# Altium schematic sheet Power - 5V0_.SchDoc
size A4
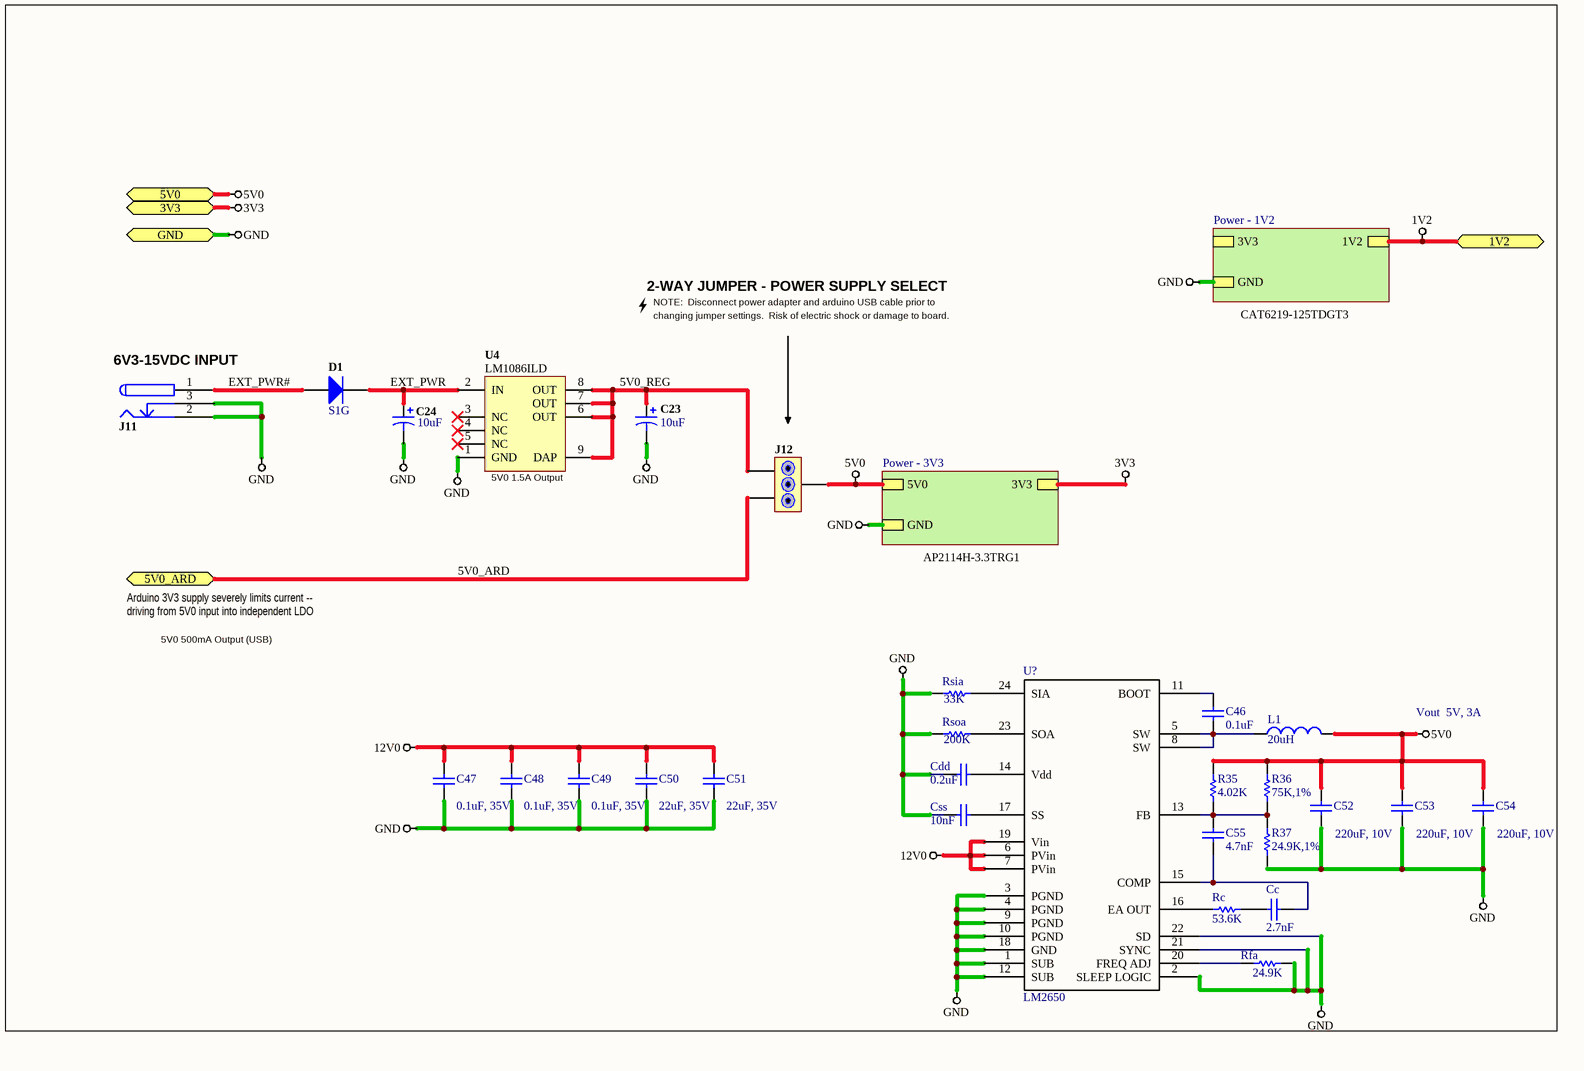
[diagram p0: Power - 5V0_.SchDoc]

## Parts
C23  Capacitance: 10uF  [AVX-CAPC3528_V]  (hidden comment: TAJB106K020R)
C24  Capacitance: 10uF  [AVX-CAPC3528_V]  (hidden comment: TAJB106K020R)
C46  value 0.1uF  [RAD-0.3]  (hidden comment: Cap)
C47  value 0.1uF, 35V  [1206]  (hidden comment: C1206)
C48  value 0.1uF, 35V  [1206]  (hidden comment: C1206)
C49  value 0.1uF, 35V  [1206]  (hidden comment: C1206)
C50  value 22uF, 35V  [1206]  (hidden comment: C1206)
C51  value 22uF, 35V  [1206]  (hidden comment: C1206)
C52  value 220uF, 10V  [1210]  (hidden comment: C1210)
C53  value 220uF, 10V  [1210]  (hidden comment: C1210)
C54  value 220uF, 10V  [1210]  (hidden comment: C1210)
C55  value 4.7nF  [RAD-0.3]  (hidden comment: Cap)
Cc  value 2.7nF  [RAD-0.3]  (hidden comment: Cap)
Cdd  value 0.2uF  [RAD-0.3]  (hidden comment: Cap)
Css  value 10nF  [RAD-0.3]  (hidden comment: Cap)
D1  S1G  [DO-214AC]
J11  PWR CONNECTOR  [PJ-102AH]  (value not drawn)
J12  3-WAY JUMPER  [HDR1X3]  (value not drawn)
L1  value 20uH  [0402-A]  (hidden comment: Inductor)
R35  value 4.02K  [AXIAL-0.3]  (hidden comment: Res1)
R36  value 75K,1%  [AXIAL-0.3]  (hidden comment: Res1)
R37  value 24.9K,1%  [AXIAL-0.3]  (hidden comment: Res1)
Rc  value 53.6K  [AXIAL-0.3]  (hidden comment: Res1)
Rfa  value 24.9K  [AXIAL-0.3]  (hidden comment: Res1)
Rsia  value 33K  [AXIAL-0.3]  (hidden comment: Res1)
Rsoa  value 200K  [AXIAL-0.3]  (hidden comment: Res1)
U4  Abbreviated Name: LM1086ILD  [LDC08A]  (hidden comment: LM1086ILD-3.3/NOPB)
U?  LM2650

## Sub-sheets
Power - 1V2 = Power - 1V2.SchDoc: GND, 3V3, 1V2
Power - 3V3 = Power - 3V3.SchDoc: GND, 5V0, 3V3

## Ports
1V2, 3V3, 5V0, 5V0_ARD, GND

## Nets
1V2: port 1V2, sheet Power - 1V2/1V2
3V3: port 3V3, sheet Power - 3V3/3V3
5V0: C52.1 C53.1 C54.1 J12.2 L1.2 R35.1 R36.1 ; port 5V0, sheet Power - 3V3/5V0
12V0: C47.1 C48.1 C49.1 C50.1 C51.1 U?.6(PVin) U?.7(PVin) U?.19(Vin)
GND: C23.2 C24.2 C47.2 C48.2 C49.2 C50.2 C51.2 C52.2 C53.2 C54.2 Cdd.1 Css.1 J11.2 J11.3 R37.2 Rfa.1 Rsia.1 Rsoa.1 U4.1(GND) U?.1(SUB) U?.2(SLEEP_LOGIC) U?.3(PGND) U?.4(PGND) U?.9(PGND) U?.10(PGND) U?.12(SUB) U?.18(GND) U?.21(SYNC) U?.22(SD) ; port GND, sheet Power - 3V3/GND, sheet Power - 1V2/GND
5V0_ARD: J12.3 ; port 5V0_ARD
5V0_REG: C23.1 J12.1 U4.6(OUT) U4.7(OUT) U4.8(OUT) U4.9(DAP)
EXT_PWR: C24.1 D1.2 U4.2(IN)
EXT_PWR#: D1.1 J11.1
NetC46_1: C46.1 U?.11(BOOT)
NetC46_2: C46.2 L1.1 U?.5(SW) U?.8(SW)
NetC55_1: C55.1 R35.2 R36.2 R37.1 U?.13(FB)
NetC55_2: C55.2 Cc.1 U?.15(COMP)
NetCc_2: Cc.2 Rc.1
NetCdd_2: Cdd.2 U?.14(Vdd)
NetCss_2: Css.2 U?.17(SS)
NetRc_2: Rc.2 U?.16(EA_OUT)
NetRfa_2: Rfa.2 U?.20(FREQ_ADJ)
NetRsia_2: Rsia.2 U?.24(SIA)
NetRsoa_2: Rsoa.2 U?.23(SOA)

Not connected (* = marked no-connect by the designer): U4 3(NC)* 4(NC)* 5(NC)*

## Notes on the sheet
- 2-WAY JUMPER - POWER SUPPLY SELECT
- NOTE:  Disconnect power adapter and arduino USB cable prior to
- (near J11) 6V3-15VDC INPUT
- changing jumper settings.  Risk of electric shock or damage to board.
- CAT6219-125TDGT3
- (near U4) 5V0 1.5A Output
- AP2114H-3.3TRG1
- Arduino 3V3 supply severely limits current --
- driving from 5V0 input into independent LDO
- 5V0 500mA Output (USB)
- Vout  5V, 3A

## Library data of the parts
C23 C24 = CMP-0279-00001-1: Capacitor, Tantalum, 10uF 10% 20V MCCT-B (3528); Manufacturer: AVX; Polarity: Polarized; PartNumber: TAJB106K020R; PackageDescription: 2-Pin SMT Capacitor, 3.5 x 2.8 mm Body; ComponentLink1URL: http://www.avx.com/; PackageReference: CAPC3528; ComponentLink2Description: Datasheet; Technology: Tantalum; ComponentLink2URL: http://www.avx.com/docs/Catalogs/taj.pdf; Tolerance: 10%; ComponentLink1Description: Manufacturer URL; Rated Voltage: 20V; DatasheetVersion: Jun-13; Mounting Technology: Surface Mount; Manufacturer_PN: TAJB106K020R; Manufacturer Part Number: TAJB106K020R
C46 C55 Cc Cdd Css = Cap: Capacitor; Published: 8-Jun-2000; LatestRevisionDate: 17-Jul-2002; LatestRevisionNote: Re-released for DXP Platform.; PackageReference: RAD-0.3; Publisher: Altium Limited; PackageDescription: Radial Cap, Thru-Hole; 2 Leads; 0.3 in Pin Spacing
C47-C51 = C1206: Ceramic Chip Capacitor - Standard; Published: 17-Jul-2002; LatestRevisionDate: 19-Mar-2004; LatestRevisionNote: Silkscreen size reduced.; DatasheetDocument: Mar-2001; PackageDocument: Mar-2001; PackageReference: 1206; Publisher: Altium Limited; Code_JEITA: 1206; Code_IPC: 3216 [1206]; ComponentLink1Description: Manufacturer Link; ComponentLink1URL: http://www.kemet.com/; ComponentLink2Description: Datasheet; ComponentLink2URL: http://www.kemet.com/kemet/web/homepage/kechome.nsf/vapubfilesname/F3102TA.pdf/$file/F3102TA.pdf
C52-C54 = C1210: Ceramic Chip Capacitor - Standard; Published: 17-Jul-2002; LatestRevisionDate: 19-Mar-2004; LatestRevisionNote: Silkscreen size reduced.; DatasheetDocument: Mar-2001; PackageDocument: Mar-2001; PackageReference: 1210; Publisher: Altium Limited; Code_JEITA: 1210; Code_IPC: 3225 [1210]; ComponentLink1Description: Manufacturer Link; ComponentLink1URL: http://www.kemet.com/; ComponentLink2Description: Datasheet; ComponentLink2URL: http://www.kemet.com/kemet/web/homepage/kechome.nsf/vapubfilesname/F3102TA.pdf/$file/F3102TA.pdf
D1 = S1G: Fairchild S1G General Purpose Rectifier; Vrrm: 400V; If(AV): 1.0A; Ifsm: 30A; Pd: 1.4W; Trr: 1.8uS; Ct: 6.6pF; Package: DO-214AC; Manufacturer_PN: S1G; Manufacturer Part Number: S1G
J11 = POWER-CONNECTOR-3: Connector, 3 Conductor Power Jack; Manufacturer_PN: CP-102AH-ND; Connector type: POWERJACK 3 HEADER; ClassName: PWR_CONN_5V0; Category: Connector; Mounting Technology: PTH; Pin Count: 3; Manufacturer Part Number: CP-102AH-ND
J12 = 3-WAY JUMPER: 3-Way Jumper - Center Output; Manufacturer_PN: 71417-103HLF; Manufacturer Part Number: 71417-103HLF
L1 = Inductor: Code_IEC: 1005; Published: 8-Jun-2000; LatestRevisionDate: 29-May-2009; LatestRevisionNote: IPC-7351 Footprint Added.; PackageReference: 0402-A; Publisher: Altium Limited; PackageDescription: Chip Inductor; Code_JEITA: 0402
R35-R37 Rc Rfa Rsia Rsoa = Res1: Resistor; Published: 8-Jun-2000; LatestRevisionDate: 17-Jul-2002; LatestRevisionNote: Re-released for DXP Platform.; PackageReference: AXIAL-0.3; Publisher: Altium Limited; PackageDescription: Axial Device, Thru-Hole; 2 Leads; 0.3 in Pin Spacing
U4 = CMP-0062-01489-2: 1.5A Low Dropout Positive Regulators, 8-pin LLP, Pb-Free; Manufacturer: National Semiconductor; PowerWise: N; CompType: LDO IC; PackageTopMarking: NS*UZXYTT*1086I33; ComponentLink1Description: LM1086 Datasheet; RoHS: Y; ComponentLink2URL: http://www.national.com/pf/LM/LM1086.html; PinCount: 8; DatasheetVersion: Jun-2005; ComponentLink2Description: LM1086 Web Page; ComponentLink3URL: http://www.national.com/packaging/folders/ldc08a.html; ComponentLink1URL: http://www.national.com/ds/LM/LM1086.pdf; PackageReference: LDC08A; PackageVersion: revB, Jun-2003; ComponentLink3Description: LDC08A Package Page; PackageDescription: LLP, Plastic, Dual, 4 x 4 x 0.75mm Body, 8 Lead, 0.8mm Pitch; RevisionNote: Component URLs added; Manufacturer_PN: LM1086ILD-3.3/NOPB; Manufacturer Part Number: LM1086ILD-3.3/NOPB